# Altium schematic sheet FT2232HL_OUT.SchDoc
size 297 x 209 mm; SheetNumber: 26; SheetTotal: 29
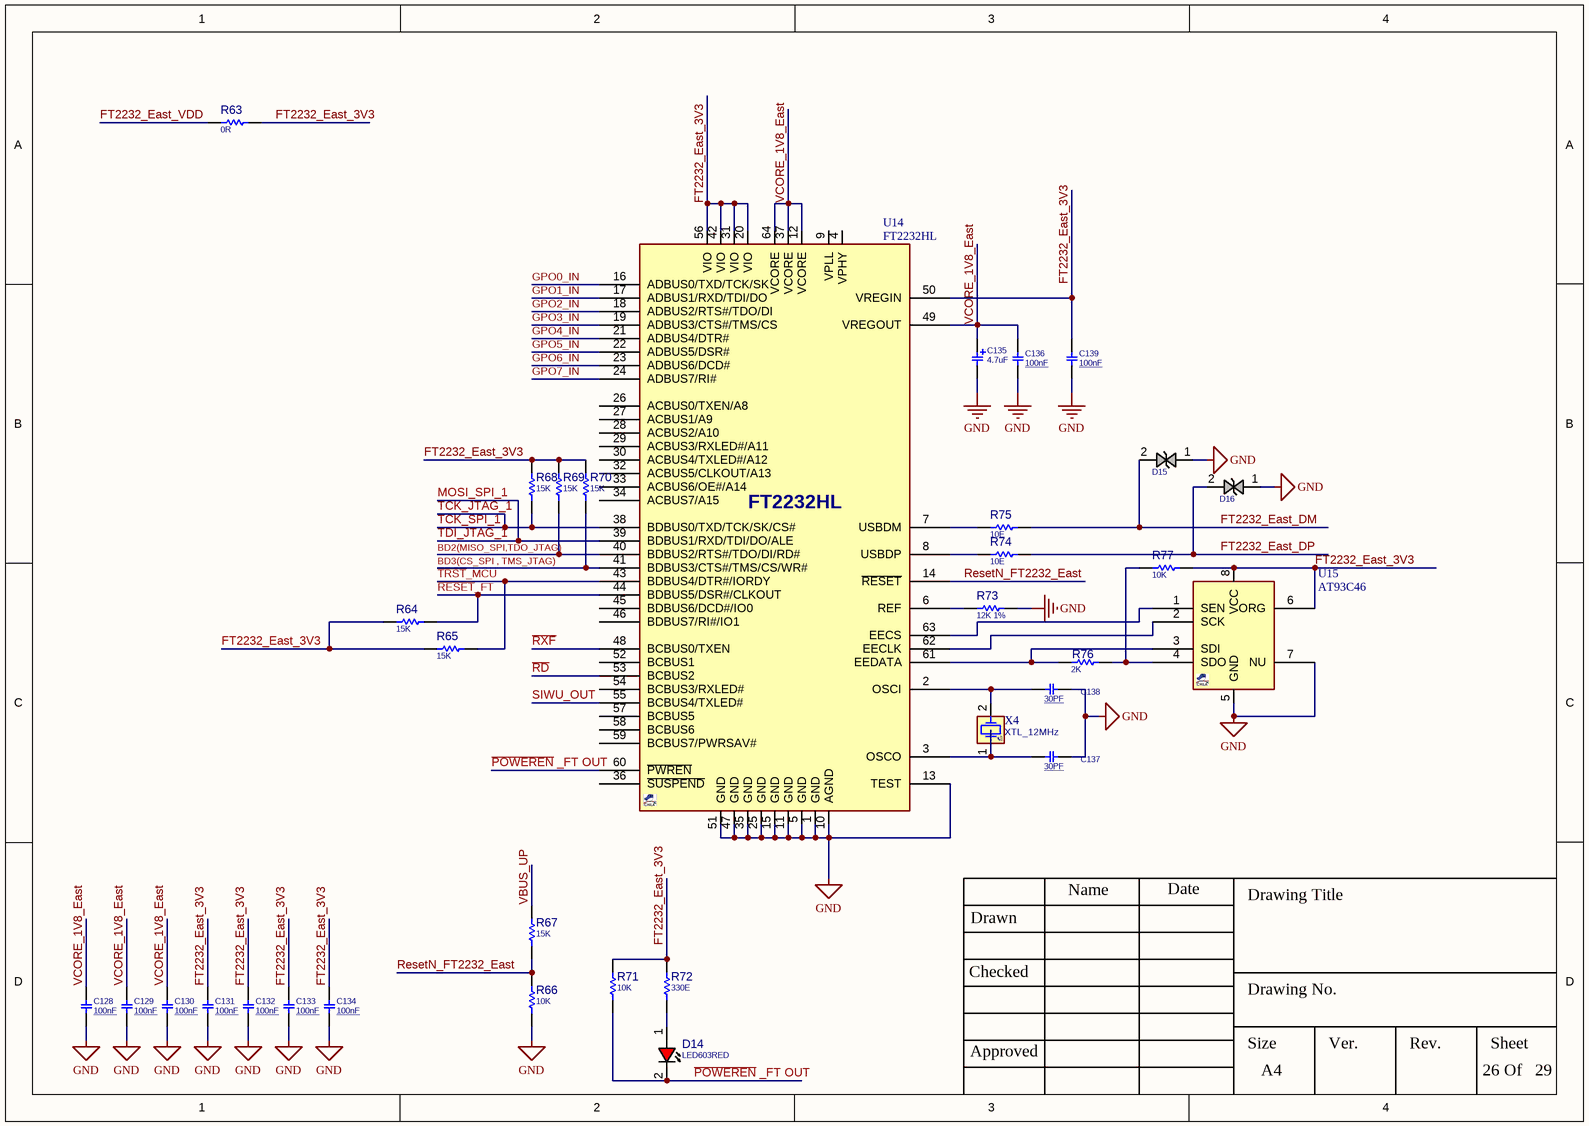
[diagram p0: FT2232HL_OUT.SchDoc]

## Parts
C128  100nF  [0603]
C129  100nF  [0603]
C130  100nF  [0603]
C131  100nF  [0603]
C132  100nF  [0603]
C133  100nF  [0603]
C134  100nF  [0603]
C135  4.7uF  [C_TN_3216]
C136  100nF  [0603]
C137  30PF  [C0805]
C138  30PF  [C0805]
C139  100nF  [0603]
D14  LED603RED  [LED0603RED]
D15  TVS603  [D0603]  (value not drawn)
D16  TVS603  [D0603]  (value not drawn)
R63  0R  [R0603]
R64  15K  [R0603]
R65  15K  [R0603]
R66  10K  [R0603]
R67  15K  [R0603]
R68  15K  [R0603]
R69  15K  [R0603]
R70  15K  [R0603]
R71  10K  [R0603]
R72  330E  [R0603]
R73  value 12K 1%  [R025W_AX04]  (hidden comment: 12K)
R74  10E  [R0603]
R75  10E  [R0603]
R76  value 2K  [R025W_AX04]  (hidden comment: 12K)
R77  value 10K  [R025W_AX04]  (hidden comment: 12K)
U14  FT2232HL  [QFG50_64]
U15  AT93C46  [SO_8]
X4  XTL_12MHz  [XTL_2_11X5]

## Nets
GND: C128.2 C129.2 C130.2 C131.2 C132.2 C133.2 C134.2 C135.2 C136.2 C137.2 C138.2 C139.2 D15.1 D16.1 R66.2 R73.1 U14.1(GND) U14.5(GND) U14.10(AGND) U14.11(GND) U14.13(TEST) U14.15(GND) U14.25(GND) U14.35(GND) U14.47(GND) U14.51(GND) U15.5(GND) U15.7(NU)
~{POWEREN} _FT OUT: D14.2(CATHODE) R71.2 U14.60(~{PWREN})
BD2(MISO_SPI,TDO_JTAG): R69.2 U14.40(BDBUS2/RTS#/TDO/DI/RD#)
BD3(CS_SPI , TMS_JTAG): R70.2 U14.41(BDBUS3/CTS#/TMS/CS/WR#)
FT2232_East_3V3: C131.1 C132.1 C133.1 C134.1 C139.1 R63.2 R64.1 R65.1 R68.1 R69.1 R70.1 R71.1 R72.1 R77.1 U14.20(VIO) U14.31(VIO) U14.42(VIO) U14.50(VREGIN) U14.56(VIO) U15.6(ORG) U15.8(VCC)
FT2232_East_DM: D15.2 R75.1
FT2232_East_DP: D16.2 R74.1
FT2232_East_VDD: R63.1
GPO0_IN: U14.16(ADBUS0/TXD/TCK/SK)
GPO1_IN: U14.17(ADBUS1/RXD/TDI/DO)
GPO2_IN: U14.18(ADBUS2/RTS#/TDO/DI)
GPO3_IN: U14.19(ADBUS3/CTS#/TMS/CS)
GPO4_IN: U14.21(ADBUS4/DTR#)
GPO5_IN: U14.22(ADBUS5/DSR#)
GPO6_IN: U14.23(ADBUS6/DCD#)
GPO7_IN: U14.24(ADBUS7/RI#)
MOSI_SPI_1: U14.39(BDBUS1/RXD/TDI/DO/ALE)  [also labelled TDI_JTAG_1]
~{RD}: U14.53(BCBUS2)
~{RESET}_FT: R64.2 U14.44(BDBUS5/DSR#/CLKOUT)
~{RXF}: U14.48(BCBUS0/TXEN)
ResetN_FT2232_East: R66.1 R67.2 U14.14(~{RESET})
SIWU_OUT: U14.55(BCBUS4/TXLED#)
~{TRST}_MCU: R65.2 U14.43(BDBUS4/DTR#/IORDY)
TCK_JTAG_1: R68.2 U14.38(BDBUS0/TXD/TCK/SK/CS#)  [also labelled TCK_SPI_1]
VBUS_UP: R67.1
VCORE_1V8_East: C128.1 C129.1 C130.1 C135.1 C136.1 U14.12(VCORE) U14.37(VCORE) U14.49(VREGOUT) U14.64(VCORE)
NetC137_1: C137.1 U14.3(OSCO) X4.1(OSC1)
NetC138_1: C138.1 U14.2(OSCI) X4.2(OSC2)
NetD14_1: D14.1(ANODE) R72.2
NetR73_2: R73.2 U14.6(REF)
NetR74_2: R74.2 U14.8(USBDP)
NetR75_2: R75.2 U14.7(USBDM)
NetR76_1: R76.1 R77.2 U15.4(SDO)
NetR76_2: R76.2 U14.61(EEDATA) U15.3(SDI)
NetU14_62: U14.62(EECLK) U15.2(SCK)
NetU14_63: U14.63(EECS) U15.1(SEN)

Not connected (* = marked no-connect by the designer): U14 4(VPHY) 9(VPLL) 26(ACBUS0/TXEN/A8) 27(ACBUS1/A9) 28(ACBUS2/A10) 29(ACBUS3/RXLED#/A11) 30(ACBUS4/TXLED#/A12) 32(ACBUS5/CLKOUT/A13) 33(ACBUS6/OE#/A14) 34(ACBUS7/A15) 36(~{SUSPEND}) 45(BDBUS6/DCD#/IO0) 46(BDBUS7/RI#/IO1) 52(BCBUS1) 54(BCBUS3/RXLED#) 57(BCBUS5) 58(BCBUS6) 59(BCBUS7/PWRSAV#)

## Notes on the sheet
- Drawn
- Name
- Date
- Drawing Title
- Checked
- Drawing No.
- Approved
- Size
- A4
- Ver.
- Rev.
- Sheet
- Of

## Library data of the parts
C128-C134 C136 C139 = CAP_SMD_FILM_1u16v_1210: CAP, FILM, 1uF, 16V, Acryl, 20%, 1210; PARAM: Acrylic, MetallizedStacked, 20%, -40~85oC; MANF_P#: ECP-U1C105MA5; MANF: Panasonic; PRICE: 100= 36$; DESC: -; PARAM2: 16V; ASSEMBLY: ASSEMBLY; VALUE: 100nF
C135 = CAP_SMD_TAN_10uF_6.3V: CAP, SMD, TAN; PARAM: 20%, 300mOhm, -55~105oC; MANF: VISHAY; MANF_P#: T55A106M6R3C0300; PARAM2: 6.3V; PRICE: 0.46$; VALUE: 4.7uF
C137 C138 = CAP_SMD_MLCC: CAP, MLCC, 1nF, 50V, C0G, 10%, 0402; MANF: Murata; PARAM: C0G, 10%; PRICE: 100= 1.4$; DESC: -; MANF_P#: -; PARAM2: 50V; ASSEMBLY: ASSEMBLY; VALUE: 30PF
D14 = LED_SMD_0603_RED: LED, SMD, 0603, RED; PARAM: 30mA, 640nm; DESC: DESCRIPTION; MANF_P#: MANF_PART#; PARAM2: 1.8~2.5V; MANF: MANF; ASSEMBLY: ASSEMBLY; PRICE: PRICE; VALUE: LED603RED
D15 D16 = TVS_PGB0010603MR: TVS, ESD PROTECT, 24VDC, Bidirectional; MANF: LittelFuse; MANF_P#: PGB0010603MR; VALUE: TVS603
R63-R72 R74 R75 = RES_SMD_0603: RESISTOR, SMD; PARAM: -W; DESC: DESCRIPTION; DIST#: MOUSER; PARAM2: 1%; MANF_P#: -; MANF: -; ASSEMBLY: ASSEMBLY; PRICE: 100= 0.5$
  R63: VALUE: 0R
  R64 R65 R67-R70: VALUE: 15K
  R66 R71: VALUE: 10K
  R72: VALUE: 330E
  R74 R75: VALUE: 10E
R73 R76 R77 = RES_THD: RESISTOR, THD; MANF_P#: RK73H1ETTP4701F; MANF: KOA SPEER; PARAM: 0.063W; DESC: DESCRIPTION; DIST#: MOUSER; PARAM2: 1%; ASSEMBLY: ASSEMBLY; PRICE: 100= 0.5$
U14 = FT2232HL_QFP64: USB, DUAL, Multipurpose UART/FIFO, USB High Speed; MANF: FTDI; PARAM2: 3.3V; MANF_P#: FT2232HL; VALUE: FT2232HL
U15 = EEPROM_SPI_AT93C46_SOP8: EEPROM, SPI, 1KBIT, SOP-8; VALUE: AT93C46
X4 = XTL_2_HC49_8MHz_SMD: Crystal MOST POPULAR ABL HC49 PACKAGE; MANF: ABRACON; MANF_P#: ABLS-8.000MHZ-B4-T; PARAM: 8MHz, 18pF, 30PPM, -20~70oC; PRICE: 0.3$; VALUE: XTL_12MHz